# EAGLE design AeroQuad_v15 (EAGLE 5.06)
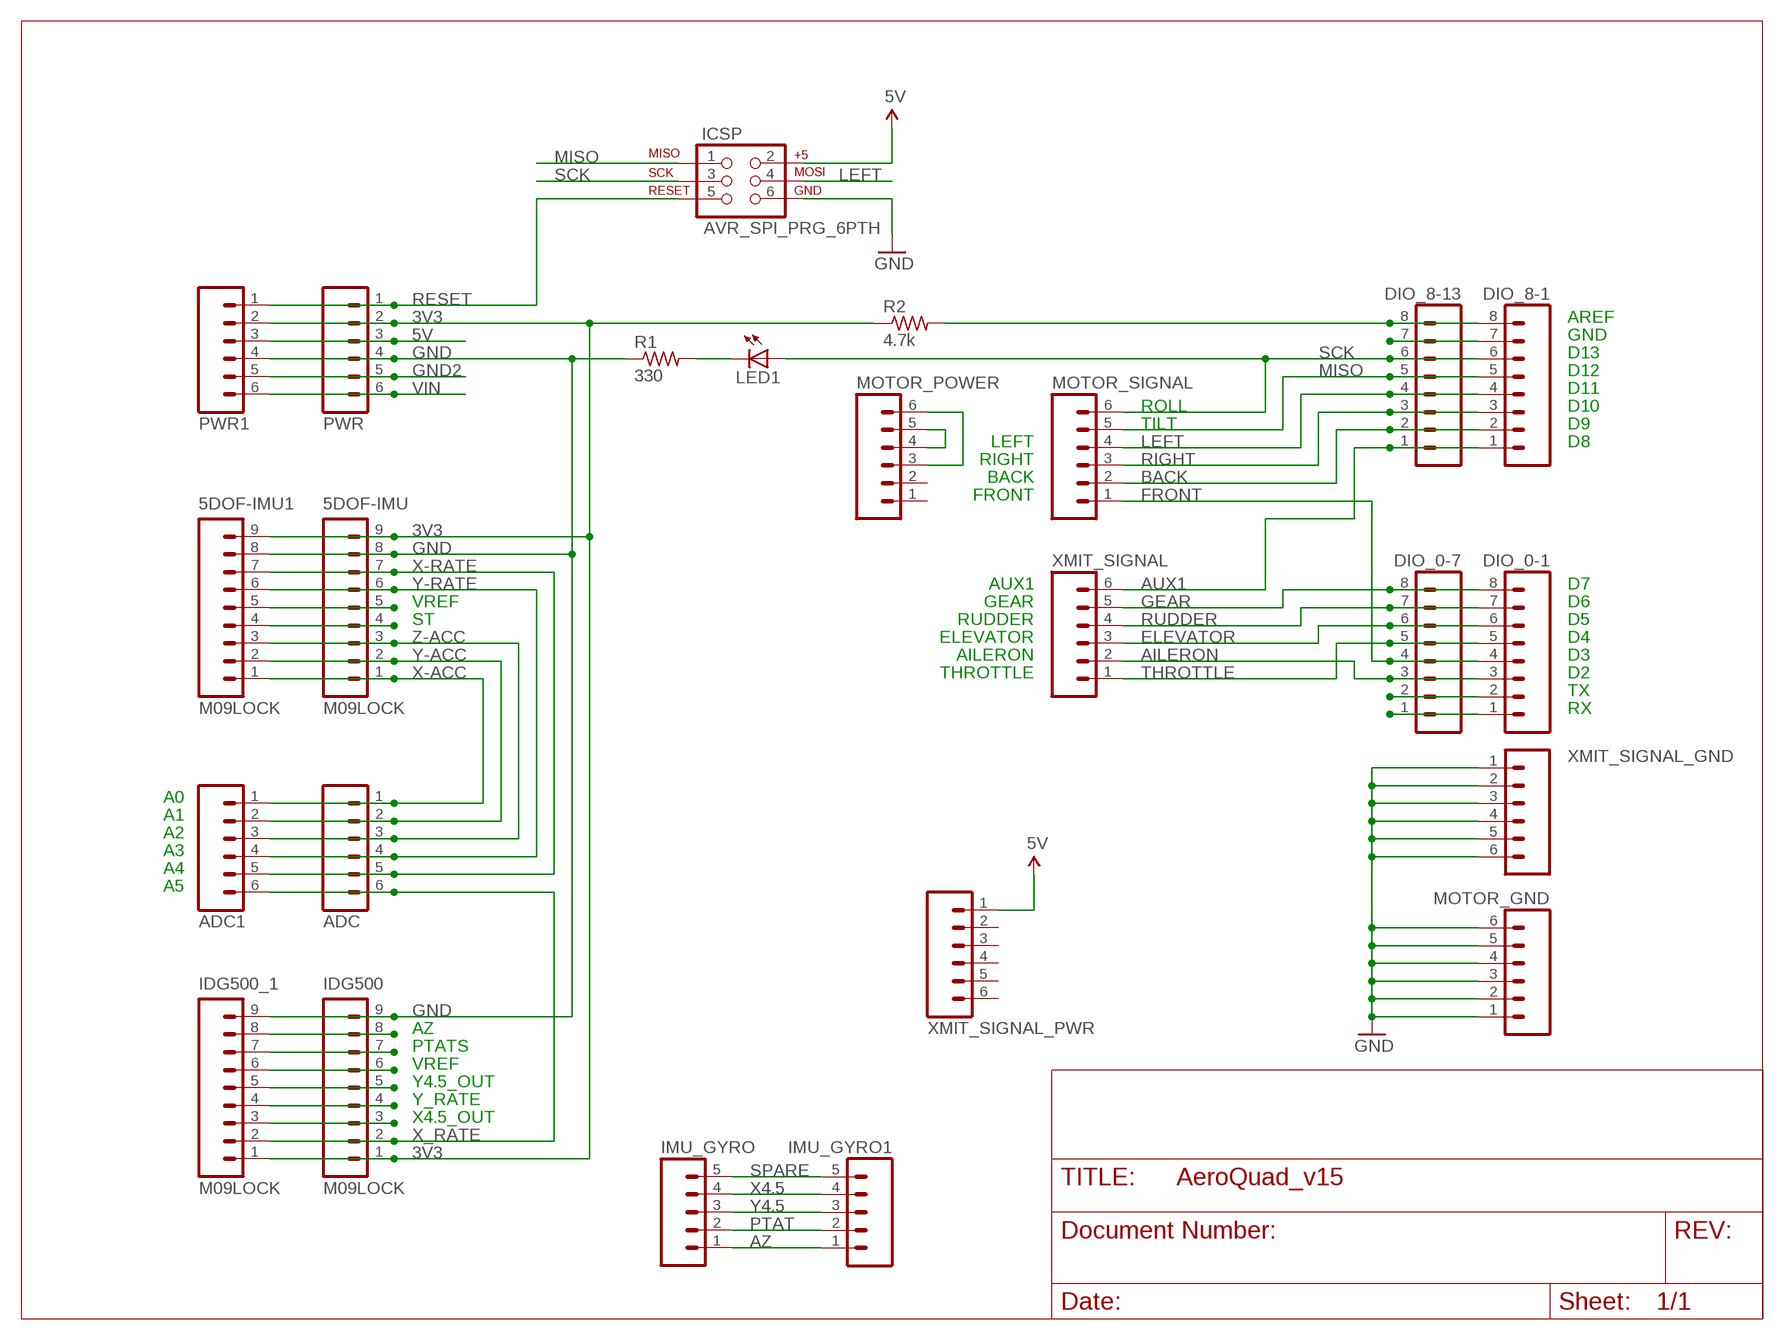
[diagram p0: schematic, sheet 1]

## Parts
5DOF-IMU  M09LOCK  [1X09_LOCK]
5DOF-IMU1  M09LOCK  [1X09_LOCK]
ADC  M06LOCK  [1X06_LOCK]
ADC1  M06LOCK  [1X06_LOCK]
DIO_0-1  M08LOCK  [1X08_LOCK]
DIO_0-7  M08LOCK  [1X08_LOCK]
DIO_8-1  M08LOCK  [1X08_LOCK]
DIO_8-13  M08LOCK  [1X08_LOCK]
ICSP  AVR_SPI_PRG_6PTH  [2X3]
IDG500  M09LOCK  [1X09_LOCK]
IDG500_1  M09LOCK  [1X09_LOCK]
IMU_GYRO  M05LOCK  [1X05_LOCK]
IMU_GYRO1  M05LOCK  [1X05_LOCK]
LED1  LED5MM  [LED5MM]
MOTOR_GND  M06LOCK  [1X06_LOCK]
MOTOR_POWER  M06LOCK  [1X06_LOCK]
MOTOR_SIGNAL  M06LOCK  [1X06_LOCK]
PWR  M06LOCK  [1X06_LOCK]
PWR1  M06LOCK  [1X06_LOCK]
R1  330  R-US_0204/5  [0204/5]
R2  4.7k  R-US_0204/5  [0204/5]
XMIT_SIGNAL  M06LOCK  [1X06_LOCK]
XMIT_SIGNAL_GND  M06LOCK  [1X06_LOCK]
XMIT_SIGNAL_PWR  M06LOCK  [1X06_LOCK]

## Nets
3V3: 5DOF-IMU1.9 5DOF-IMU.9 IDG500.1 IDG500_1.1 PWR1.2 PWR.2 R2.1
5V: ICSP.2 PWR1.3 PWR.3 XMIT_SIGNAL_PWR.1
AILERON: DIO_0-1.3 DIO_0-7.3 XMIT_SIGNAL.2
AREF: DIO_8-1.8 DIO_8-13.8 R2.2
AUX1: DIO_8-1.1 DIO_8-13.1 XMIT_SIGNAL.6
AZ: IMU_GYRO1.1 IMU_GYRO.1
BACK: DIO_8-1.2 DIO_8-13.2 MOTOR_SIGNAL.2
ELEVATOR: DIO_0-1.6 DIO_0-7.6 XMIT_SIGNAL.3
FRONT: DIO_0-1.4 DIO_0-7.4 MOTOR_SIGNAL.1
GEAR: DIO_0-1.8 DIO_0-7.8 XMIT_SIGNAL.5
GND: 5DOF-IMU1.8 5DOF-IMU.8 ICSP.6 IDG500.9 IDG500_1.9 MOTOR_GND.1 MOTOR_GND.2 MOTOR_GND.3 MOTOR_GND.4 MOTOR_GND.5 MOTOR_GND.6 PWR1.4 PWR.4 R1.1 XMIT_SIGNAL_GND.1 XMIT_SIGNAL_GND.2 XMIT_SIGNAL_GND.3 XMIT_SIGNAL_GND.4 XMIT_SIGNAL_GND.5 XMIT_SIGNAL_GND.6
GND2: PWR1.5 PWR.5
LEFT: DIO_8-1.4 DIO_8-13.4 ICSP.4 MOTOR_SIGNAL.4
MISO: DIO_8-1.5 DIO_8-13.5 ICSP.1 MOTOR_SIGNAL.5
N$1: DIO_8-1.7 DIO_8-13.7
N$2: LED1.K(C) R1.2
N$9: 5DOF-IMU1.5 5DOF-IMU.5
N$11: 5DOF-IMU1.4 5DOF-IMU.4
N$12: IDG500.8 IDG500_1.8
N$13: IDG500.7 IDG500_1.7
N$15: IDG500.6 IDG500_1.6
N$16: IDG500.5 IDG500_1.5
N$17: IDG500.4 IDG500_1.4
N$18: IDG500.3 IDG500_1.3
N$19: MOTOR_POWER.4 MOTOR_POWER.5
N$20: MOTOR_POWER.3 MOTOR_POWER.6
N$25: DIO_0-1.2 DIO_0-7.2
N$26: DIO_0-1.1 DIO_0-7.1
PTAT: IMU_GYRO1.2 IMU_GYRO.2
RESET: ICSP.5 PWR1.1 PWR.1
RIGHT: DIO_8-1.3 DIO_8-13.3 MOTOR_SIGNAL.3
RUDDER: DIO_0-1.7 DIO_0-7.7 XMIT_SIGNAL.4
SCK: DIO_8-1.6 DIO_8-13.6 ICSP.3 LED1.A MOTOR_SIGNAL.6
SPARE: IMU_GYRO1.5 IMU_GYRO.5
THROTTLE: DIO_0-1.5 DIO_0-7.5 XMIT_SIGNAL.1
VIN: PWR1.6 PWR.6
X4.5: IMU_GYRO1.4 IMU_GYRO.4
X-ACC: 5DOF-IMU1.1 5DOF-IMU.1 ADC1.1 ADC.1
X-RATE: 5DOF-IMU1.7 5DOF-IMU.7 ADC1.5 ADC.5
X_RATE: ADC1.6 ADC.6 IDG500.2 IDG500_1.2
Y4.5: IMU_GYRO1.3 IMU_GYRO.3
Y-ACC: 5DOF-IMU1.2 5DOF-IMU.2 ADC1.2 ADC.2
Y-RATE: 5DOF-IMU1.6 5DOF-IMU.6 ADC1.4 ADC.4
Z-ACC: 5DOF-IMU1.3 5DOF-IMU.3 ADC1.3 ADC.3
Unconnected: MOTOR_POWER.1 MOTOR_POWER.2 XMIT_SIGNAL_PWR.2 XMIT_SIGNAL_PWR.3 XMIT_SIGNAL_PWR.4 XMIT_SIGNAL_PWR.5 XMIT_SIGNAL_PWR.6

## Notes on the sheet
- AREF
- GND
- D13
- D12
- D11
- ROLL | D10
- TILT | D9
- LEFT | D8
- RIGHT
- BACK
- FRONT
- AUX1 | D7
- VREF | GEAR | D6
- ST | RUDDER | D5
- ELEVATOR | D4
- AILERON | D3
- THROTTLE | D2
- TX
- RX
- A0
- A1
- A2
- A3
- A4
- A5
- AZ
- PTATS
- VREF
- Y4.5_OUT
- Y_RATE
- X4.5_OUT

## Library data of the parts
5DOF-IMU 5DOF-IMU1 IDG500 IDG500_1 = SparkFun:M09: Header 9 Standard 9-pin 0.1" header. Use with straight break away headers (SKU : PRT-00116), right angle break away headers (PRT-00553), swiss pins (PRT-00743), machine pins (PRT-00117), and female headers (PRT-00115).
ADC ADC1 MOTOR_GND MOTOR_POWER MOTOR_SIGNAL PWR PWR1 XMIT_SIGNAL XMIT_SIGNAL_GND XMIT_SIGNAL_PWR = SparkFun:M06: Header 6 Standard 6-pin 0.1" header. Use with straight break away headers (SKU : PRT-00116), right angle break away headers (PRT-00553), swiss pins (PRT-00743), machine pins (PRT-00117), and female headers (PRT-00115). Molex polarized connector foot print use with SKU : PRT-08094 with associated crimp pins and housings. NOTES ON THE VARIANTS LOCK and LOCK_LONGPADS... This footprint was designed to help hold the alignment of a through-hole component (i.e. 6-pin header) while soldering it into place. You may notice that each hole has been shifted either up or down by 0.005 of an inch from it's more standard position (which is a perfectly straight line). This slight alteration caused the pins (the squares in the middle) to touch the edges of the holes. Because they are alternating, it causes a "brace" to hold the component in place. 0.005 has proven to be the perfect amount of "off-center" position when using our standard breakaway headers. Although looks a little odd when you look at the bare footprint, once you have a header in there, the alteration is very hard to notice. Also, if you push a header all the way into place, it is covered up entirely on the bottom side. This idea of altering the position of holes to aid alignment will be further integrated into the Sparkfun Library for other footprints. It can help hold any component with 3 or more connection pins.
DIO_0-1 DIO_0-7 DIO_8-1 DIO_8-13 = SparkFun:M08: Header 8 Standard 8-pin 0.1" header. Use with straight break away headers (SKU : PRT-00116), right angle break away headers (PRT-00553), swiss pins (PRT-00743), machine pins (PRT-00117), and female headers (PRT-00115).
ICSP = SparkFun:AVR_SPI_PRG_6: AVR ISP 6 Pin This is the reduced ISP connector for AVR programming. Common on Arduino. This footprint will take up less PCB space and can be used with a 10-pin to 6-pin adapter such as SKU: BOB-08508
IMU_GYRO IMU_GYRO1 = SparkFun:M05: Header 5 Standard 5-pin 0.1" header. Use with straight break away headers (SKU : PRT-00116), right angle break away headers (PRT-00553), swiss pins (PRT-00743), machine pins (PRT-00117), and female headers (PRT-00115). Molex polarized connector foot print use with SKU : PRT-08230 with associated crimp pins and housings.
LED1 = SparkFun:LED: LEDs Standard schematic elements and footprints for 5mm, 3mm, 1206, and 0603 sized LEDs. 5mm - Spark Fun Electronics SKU : COM-00529 (and others)
R1 R2 = resistor:R-US_: RESISTOR, American symbol

## Board
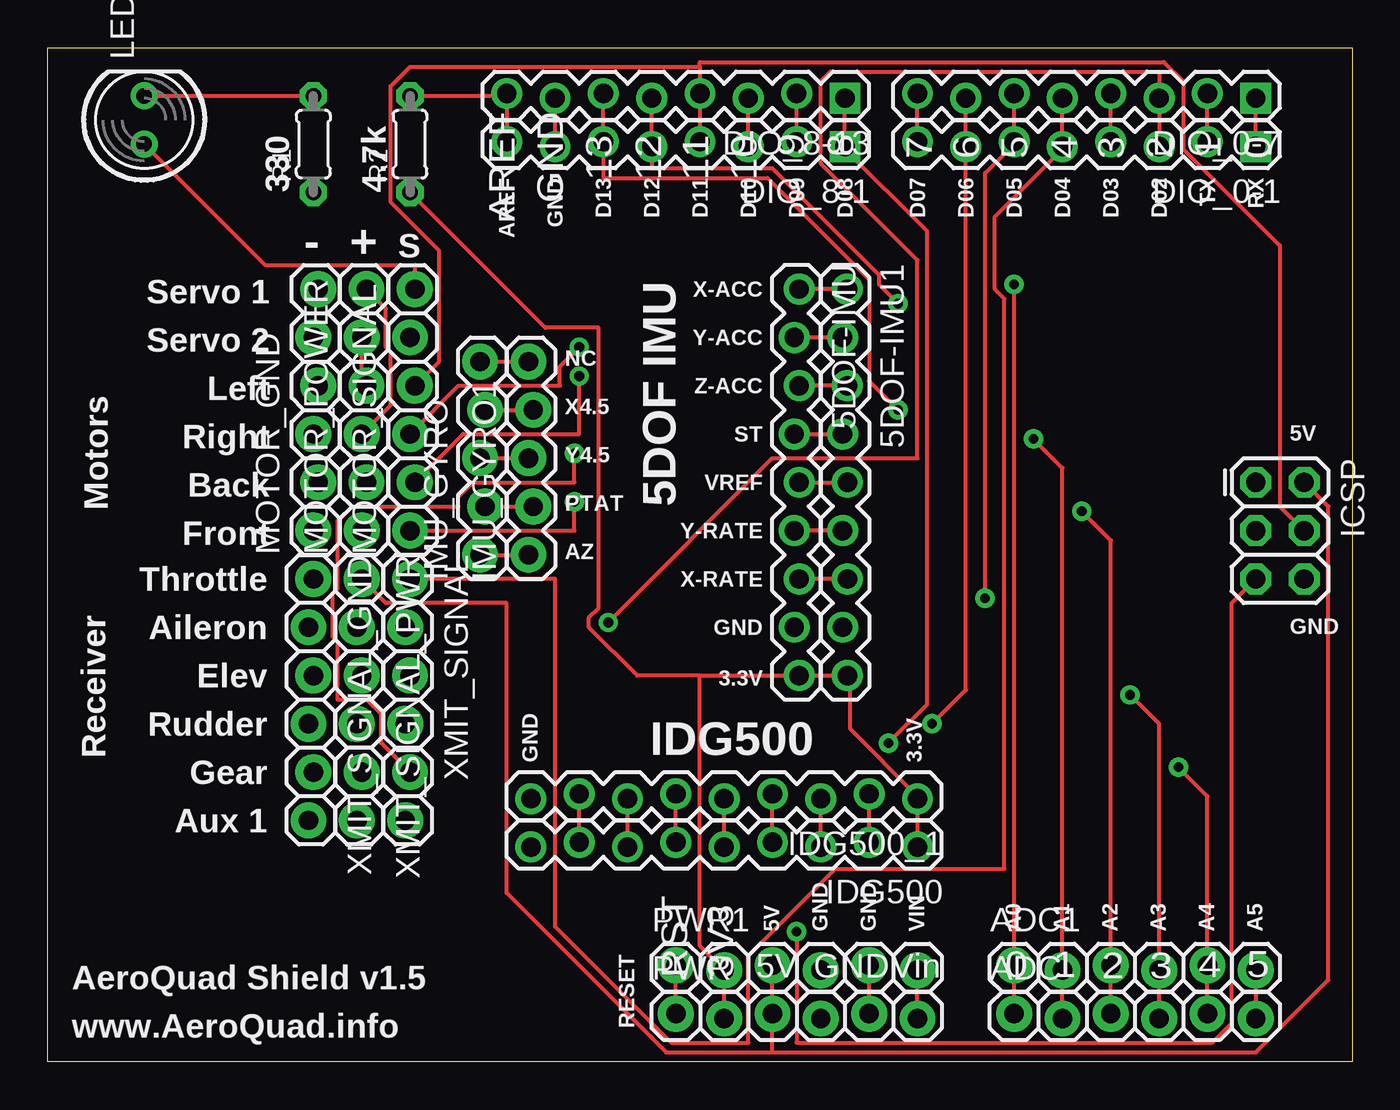
[diagram p1: board, top side]
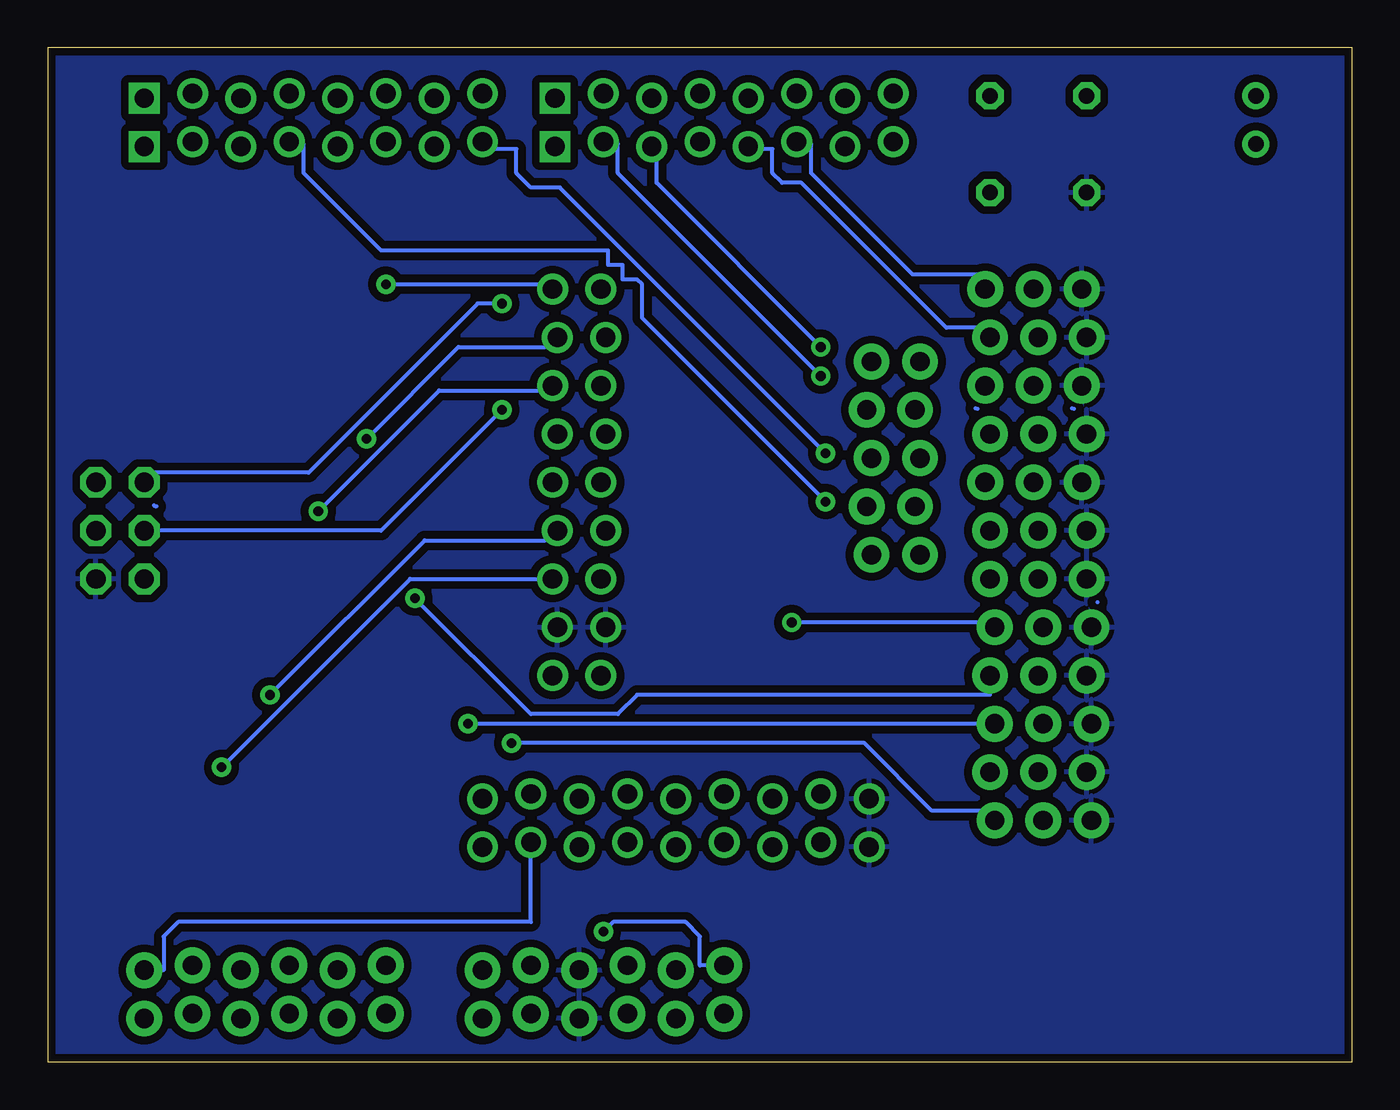
[diagram p2: board, bottom side, seen from below]

Size 68.58 x 53.34 mm. Coordinates in mm from the lower left corner, seen from the top.
Outline: 0,53.34 68.58,53.34 68.58,0 0,0 0,53.34
Copper layers (1*16): Top 0.035mm / dielectric 1.5mm / Bottom 0.035mm
Design rules "SparkFun": minimum track width 8mil, minimum drill 20mil, track to track 8mil, track to pad 8mil, pad to pad 8mil, via to via 8mil, smd to smd 8mil, copper to edge 10mil, drill to drill 8mil, minimum pad ring 12mil, minimum via ring 10mil, stop-mask expansion 4mil, vias tented up to drill 25mil, thermal gap 10mil

### Footprints (pad centres in the part's own frame; a part is rotated, then mirrored left to right if it is on the bottom)
1X09_LOCK = drill 1.016 round: 1 0,0.127; 2 2.54,-0.127; 3 5.08,0.127; 4 7.62,-0.127; 5 10.16,0.127; 6 12.7,-0.127; 7 15.24,0.127; 8 17.78,-0.127; 9 20.32,0.127
1X06_LOCK = drill 1.016 pad 1.88 round: 1 0,0; 2 2.54,-0.254; 3 5.08,0; 4 7.62,-0.254; 5 10.16,0; 6 12.7,-0.254
1X08_LOCK = drill 1.016 square: 1 0,0.127 | drill 1.016 round: 2 2.54,-0.127; 3 5.08,0.127; 4 7.62,-0.127; 5 10.16,0.127; 6 12.7,-0.127; 7 15.24,0.127; 8 17.78,-0.127
2X3 = drill 1.016 octagon: 1 0,0; 2 0,2.54; 3 2.54,0; 4 2.54,2.54; 5 5.08,0; 6 5.08,2.54
1X05_LOCK = drill 1.016 pad 1.88 round: 1 0,0.127; 2 2.54,-0.127; 3 5.08,0.127; 4 7.62,-0.127; 5 10.16,0.127
LED5MM = drill 0.813 round: A -1.27,0; K 1.27,0
0204/5 = drill 0.813 octagon: 1 -2.54,0; 2 2.54,0

### Placement (x,y rotation side)
5DOF-IMU  39.37,40.64 270 top
5DOF-IMU1  41.91,40.64 270 top
ADC  50.8,2.54 0 top
ADC1  50.8,5.08 0 top
DIO_0-1  63.5,48.26 180 top
DIO_0-7  63.5,50.8 180 top
DIO_8-1  41.91,48.26 180 top
DIO_8-13  41.91,50.8 180 top
ICSP  63.5,30.48 270 top
IDG500  45.72,11.43 180 top
IDG500_1  45.72,13.97 180 top
IMU_GYRO  22.86,26.67 90 top
IMU_GYRO1  25.4,26.67 90 top
LED1  5.08,49.53 90 top
MOTOR_GND  13.97,27.94 90 top
MOTOR_POWER  16.51,27.94 90 top
MOTOR_SIGNAL  19.05,27.94 90 top
PWR  33.02,2.54 0 top
PWR1  33.02,5.08 0 top
R1  13.97,48.26 90 top
R2  19.05,48.26 90 top
XMIT_SIGNAL  19.05,25.4 270 top
XMIT_SIGNAL_GND  13.97,25.4 270 top
XMIT_SIGNAL_PWR  16.51,25.4 270 top

### Tracks (layer width: path | path; a pad name or v marks a point on that pad's centre or on a via)
3V3
  Top 0.203: PWR.2 PWR1.2 34.29,6.1 34.29,20.32 | IDG500.1 IDG500_1.1 45.72,13.97 42.16,17.53 42.16,20.32 5DOF-IMU1.9 5DOF-IMU.9 34.29,20.32 | R2.1 26.16,38.61 28.96,38.61 28.96,23.88 28.45,23.37 28.45,22.86 30.99,20.32 34.29,20.32
5V
  Top 0.203: ICSP.2 67.31,29.21 67.31,4.32 63.5,0.51 38.1,0.51 | 38.1,0.51 PWR.3 PWR1.3 | XMIT_SIGNAL_PWR.1 17.78,24.13 24.13,24.13 24.13,8.89 32.51,0.51 38.1,0.51
AILERON  (via drill 0.51)
  Top 0.203: DIO_0-1.3 DIO_0-7.3 58.42,52.07 41.15,52.07 40.64,51.56 40.64,47.24 45.72,42.16 45.72,31.75 38.1,31.75 v29.46,23.11
  Bottom 0.203: XMIT_SIGNAL.2 19.05,23.11 v29.46,23.11
AREF
  Top 0.203: R2.2 24.13,50.8 | 24.13,50.8 DIO_8-1.8 | 24.13,50.8 DIO_8-13.8
AUX1  (via drill 0.51)
  Top 0.203: DIO_8-13.1 DIO_8-1.1 41.91,48.01 46.23,43.69 46.23,18.8 v44.2,16.76
  Bottom 0.203: XMIT_SIGNAL.6 19.3,13.21 22.1,13.21 25.65,16.76 v44.2,16.76
AZ
  Top 0.203: IMU_GYRO.1 IMU_GYRO1.1
BACK  (via drill 0.51)
  Top 0.203: DIO_8-1.2 DIO_8-13.2 | MOTOR_SIGNAL.2 21.84,33.02 27.94,33.02 v27.94,36.07
  Bottom 0.203: v27.94,36.07 38.61,46.74 38.61,48.26 39.37,48.26 DIO_8-1.2
ELEVATOR  (via drill 0.51)
  Top 0.203: DIO_0-7.6 DIO_0-1.6 50.8,48.26 49.28,46.74 v49.28,24.38
  Bottom 0.203: XMIT_SIGNAL.3 19.05,19.3 37.59,19.3 38.61,18.29 43.18,18.29 v49.28,24.38
FRONT  (via drill 0.51)
  Top 0.203: DIO_0-1.4 DIO_0-7.4 | MOTOR_SIGNAL.1 27.69,27.94 v27.69,29.46
  Bottom 0.203: v27.69,29.46 37.34,39.12 37.34,40.89 37.59,41.15 38.35,41.15 38.35,41.91 39.12,41.91 39.12,42.67 51.05,42.67 55.12,46.74 55.12,48.26 55.88,48.26 DIO_0-1.4
GEAR  (via drill 0.51)
  Top 0.203: DIO_0-1.8 DIO_0-7.8 | XMIT_SIGNAL.5 17.53,16.76 17.53,18.29 16.76,19.05 15.24,19.05 15.24,22.1 14.99,22.35 14.99,24.64 15.24,24.89 15.24,28.45 16,29.21 21.59,29.21 21.59,29.72 22.35,30.48 27.69,30.48 v27.69,32
  Bottom 0.203: v27.69,32 41.66,45.97 43.18,45.97 43.94,46.74 43.94,48.01 45.47,48.01 45.72,48.26 DIO_0-1.8
GND
  pour Bottom (isolate 0.406): 0,53.34 68.58,53.34 68.58,0 0,0
GND2
  Top 0.203: PWR.5 PWR1.5
LEFT
  Top 0.203: DIO_8-1.4 DIO_8-13.4 34.29,52.32 | ICSP.4 64.77,29.21 64.77,42.93 59.69,48.01 59.69,51.56 58.67,52.58 34.29,52.58 34.29,52.32 | MOTOR_SIGNAL.4 20.57,36.83 20.57,42.67 18.03,45.21 18.03,51.31 19.05,52.32 34.29,52.32
MISO  (via drill 0.51)
  Top 0.203: DIO_8-13.5 DIO_8-1.5 31.75,46.99 38.1,46.99 43.69,41.4 43.69,40.89 v44.7,39.88
  Bottom 0.203: ICSP.1 62.99,30.99 54.86,30.99 45.97,39.88 v44.7,39.88 | MOTOR_SIGNAL.5 19.56,38.61 21.34,38.61 28.96,46.23 29.97,46.23 30.48,46.74 30.48,48.01 31.75,48.01 DIO_8-1.5
N$1
  Top 0.203: DIO_8-1.7 DIO_8-13.7
N$2
  Top 0.203: LED1.K R1.2
N$5
  Bottom 0.203: 62.99,29.26 62.87,29.21
N$7
  Bottom 0.203: 19.71,34.34 19.81,34.37
N$8
  Bottom 0.203: 13.41,24.18 13.39,24.18
N$9
  Top 0.203: 5DOF-IMU.5 5DOF-IMU1.5
N$10
  Bottom 0.203: 14.63,34.34 14.73,34.37
N$11
  Top 0.203: 5DOF-IMU.4 5DOF-IMU1.4
N$12
  Top 0.203: IDG500.8 IDG500_1.8
N$13
  Top 0.203: IDG500.7 IDG500_1.7
N$15
  Top 0.203: IDG500.6 IDG500_1.6
N$16
  Top 0.203: IDG500.5 IDG500_1.5
N$17
  Top 0.203: IDG500.4 IDG500_1.4
N$18
  Top 0.203: IDG500.3 IDG500_1.3
N$19
  Top 0.203: MOTOR_POWER.4 16.51,35.81 MOTOR_POWER.5
N$20
  Top 0.203: MOTOR_POWER.3 18.03,34.54 18.03,37.34 17.78,37.59 17.78,39.62 MOTOR_POWER.6
N$25
  Top 0.203: DIO_0-1.2 DIO_0-7.2
N$26
  Top 0.203: DIO_0-1.1 DIO_0-7.1
PTAT
  Top 0.203: IMU_GYRO.2 IMU_GYRO1.2
RESET  (via drill 0.51)
  Top 0.203: ICSP.5 62.23,24.13 62.23,2.03 61.21,1.02 39.37,1.02 v39.37,6.86 | PWR.1 PWR1.1
  Bottom 0.203: v39.37,6.86 38.86,7.37 35.05,7.37 34.29,6.6 34.29,5.08 PWR1.1
RIGHT  (via drill 0.51)
  Top 0.203: DIO_8-1.3 DIO_8-13.3 | MOTOR_SIGNAL.3 21.59,35.56 26.92,35.56 26.92,36.58 v27.94,37.59
  Bottom 0.203: v27.94,37.59 36.58,46.23 36.58,48.01 36.83,48.01 DIO_8-1.3
RUDDER  (via drill 0.51)
  Top 0.203: DIO_0-7.7 DIO_0-1.7 48.26,19.56 v46.48,17.78
  Bottom 0.203: XMIT_SIGNAL.4 v46.48,17.78
SCK  (via drill 0.51)
  Top 0.203: LED1.A 11.43,41.91 19.3,41.91 MOTOR_SIGNAL.6 | DIO_8-13.6 DIO_8-1.6 29.21,46.48 37.85,46.48 43.18,41.15 43.18,35.81 v44.7,34.29
  Bottom 0.203: ICSP.3 51.05,27.94 v44.7,34.29 | MOTOR_SIGNAL.6 19.3,41.4 23.11,41.4 28.45,46.74 28.45,48.26 29.21,48.26 DIO_8-1.6
SPARE
  Top 0.203: IMU_GYRO.5 IMU_GYRO1.5
THROTTLE
  Top 0.203: DIO_0-7.5 DIO_0-1.5 53.34,48.01 49.78,44.45 49.78,40.64 50.29,40.13 50.29,10.16 41.4,10.16 36.83,5.59 36.83,1.02 32.77,1.02 26.67,7.11 26.67,25.4 XMIT_SIGNAL.1
VIN
  Top 0.203: PWR.6 PWR1.6
X4.5
  Top 0.203: IMU_GYRO.4 IMU_GYRO1.4
X-ACC  (via drill 0.51)
  Top 0.203: 5DOF-IMU1.1 5DOF-IMU.1 | ADC.1 ADC1.1 v50.8,40.89
  Bottom 0.203: v50.8,40.89 42.42,40.89 42.16,40.64 5DOF-IMU1.1
X-RATE  (via drill 0.51)
  Top 0.203: 5DOF-IMU1.7 5DOF-IMU.7 | ADC.5 ADC1.5 60.96,13.97 v59.44,15.49
  Bottom 0.203: v59.44,15.49 49.53,25.4 5DOF-IMU1.7
X_RATE
  Top 0.203: IDG500.2 IDG500_1.2 | ADC1.6 ADC.6
  Bottom 0.203: ADC1.6 62.48,4.83 62.48,6.6 61.72,7.37 43.18,7.37 IDG500.2
Y4.5
  Top 0.203: IMU_GYRO.3 IMU_GYRO1.3
Y-ACC  (via drill 0.51)
  Top 0.203: 5DOF-IMU1.2 5DOF-IMU.2 | ADC.2 ADC1.2 53.34,31.24 v51.82,32.77
  Bottom 0.203: v51.82,32.77 46.99,37.59 42.42,37.59 41.91,38.1 5DOF-IMU1.2
Y-RATE  (via drill 0.51)
  Top 0.203: 5DOF-IMU1.6 5DOF-IMU.6 | ADC.4 ADC1.4 58.42,17.78 v56.9,19.3
  Bottom 0.203: v56.9,19.3 48.77,27.43 42.42,27.43 41.91,27.94 5DOF-IMU1.6
Z-ACC  (via drill 0.51)
  Top 0.203: 5DOF-IMU1.3 5DOF-IMU.3 | ADC.3 ADC1.3 55.88,27.43 v54.36,28.96
  Bottom 0.203: v54.36,28.96 48.01,35.31 42.42,35.31 42.16,35.56 5DOF-IMU1.3

### Text on the board
tPlace: 330 | 4.7k | AREF | GND | D13 | D12 | D11 | D10 | D09 | D08 | D07 | D06 | D05 | D04 | D03 | D02 | TX | RX | - | + | S | Servo 1 | X-ACC | Servo 2 | Y-ACC | NC | Left | Z-ACC | Motors | Right | X4.5 | ST | 5V | Back | Y4.5 | VREF | PTAT | 5DOF IMU | Front | Y-RATE | Throttle | AZ | X-RATE | Receiver | Aileron | GND | GND | Elev | 3.3V | Rudder | IDG500 | Gear | GND | 3.3V | Aux 1 | 5V | GND | GND | VIN | A0 | A1 | A2 | A3 | A4 | A5 | AeroQuad Shield v1.5 | RESET | www.AeroQuad.info
tNames: 9 | 8 | 7 | 6 | 5 | 4 | 3 | 2 | 1 | 0 | 13 | 12 | 11 | 10 | GND | AREF | RST | 3V3 | 5V | GND | Vin | 0 | 1 | 2 | 3 | 4 | 5